# Altium schematic sheet connectors-extension.SchDoc
size A3; DocumentNumber: 10; SheetNumber: 10; SheetTotal: 45; SheetDescription: Connector to Extension Board
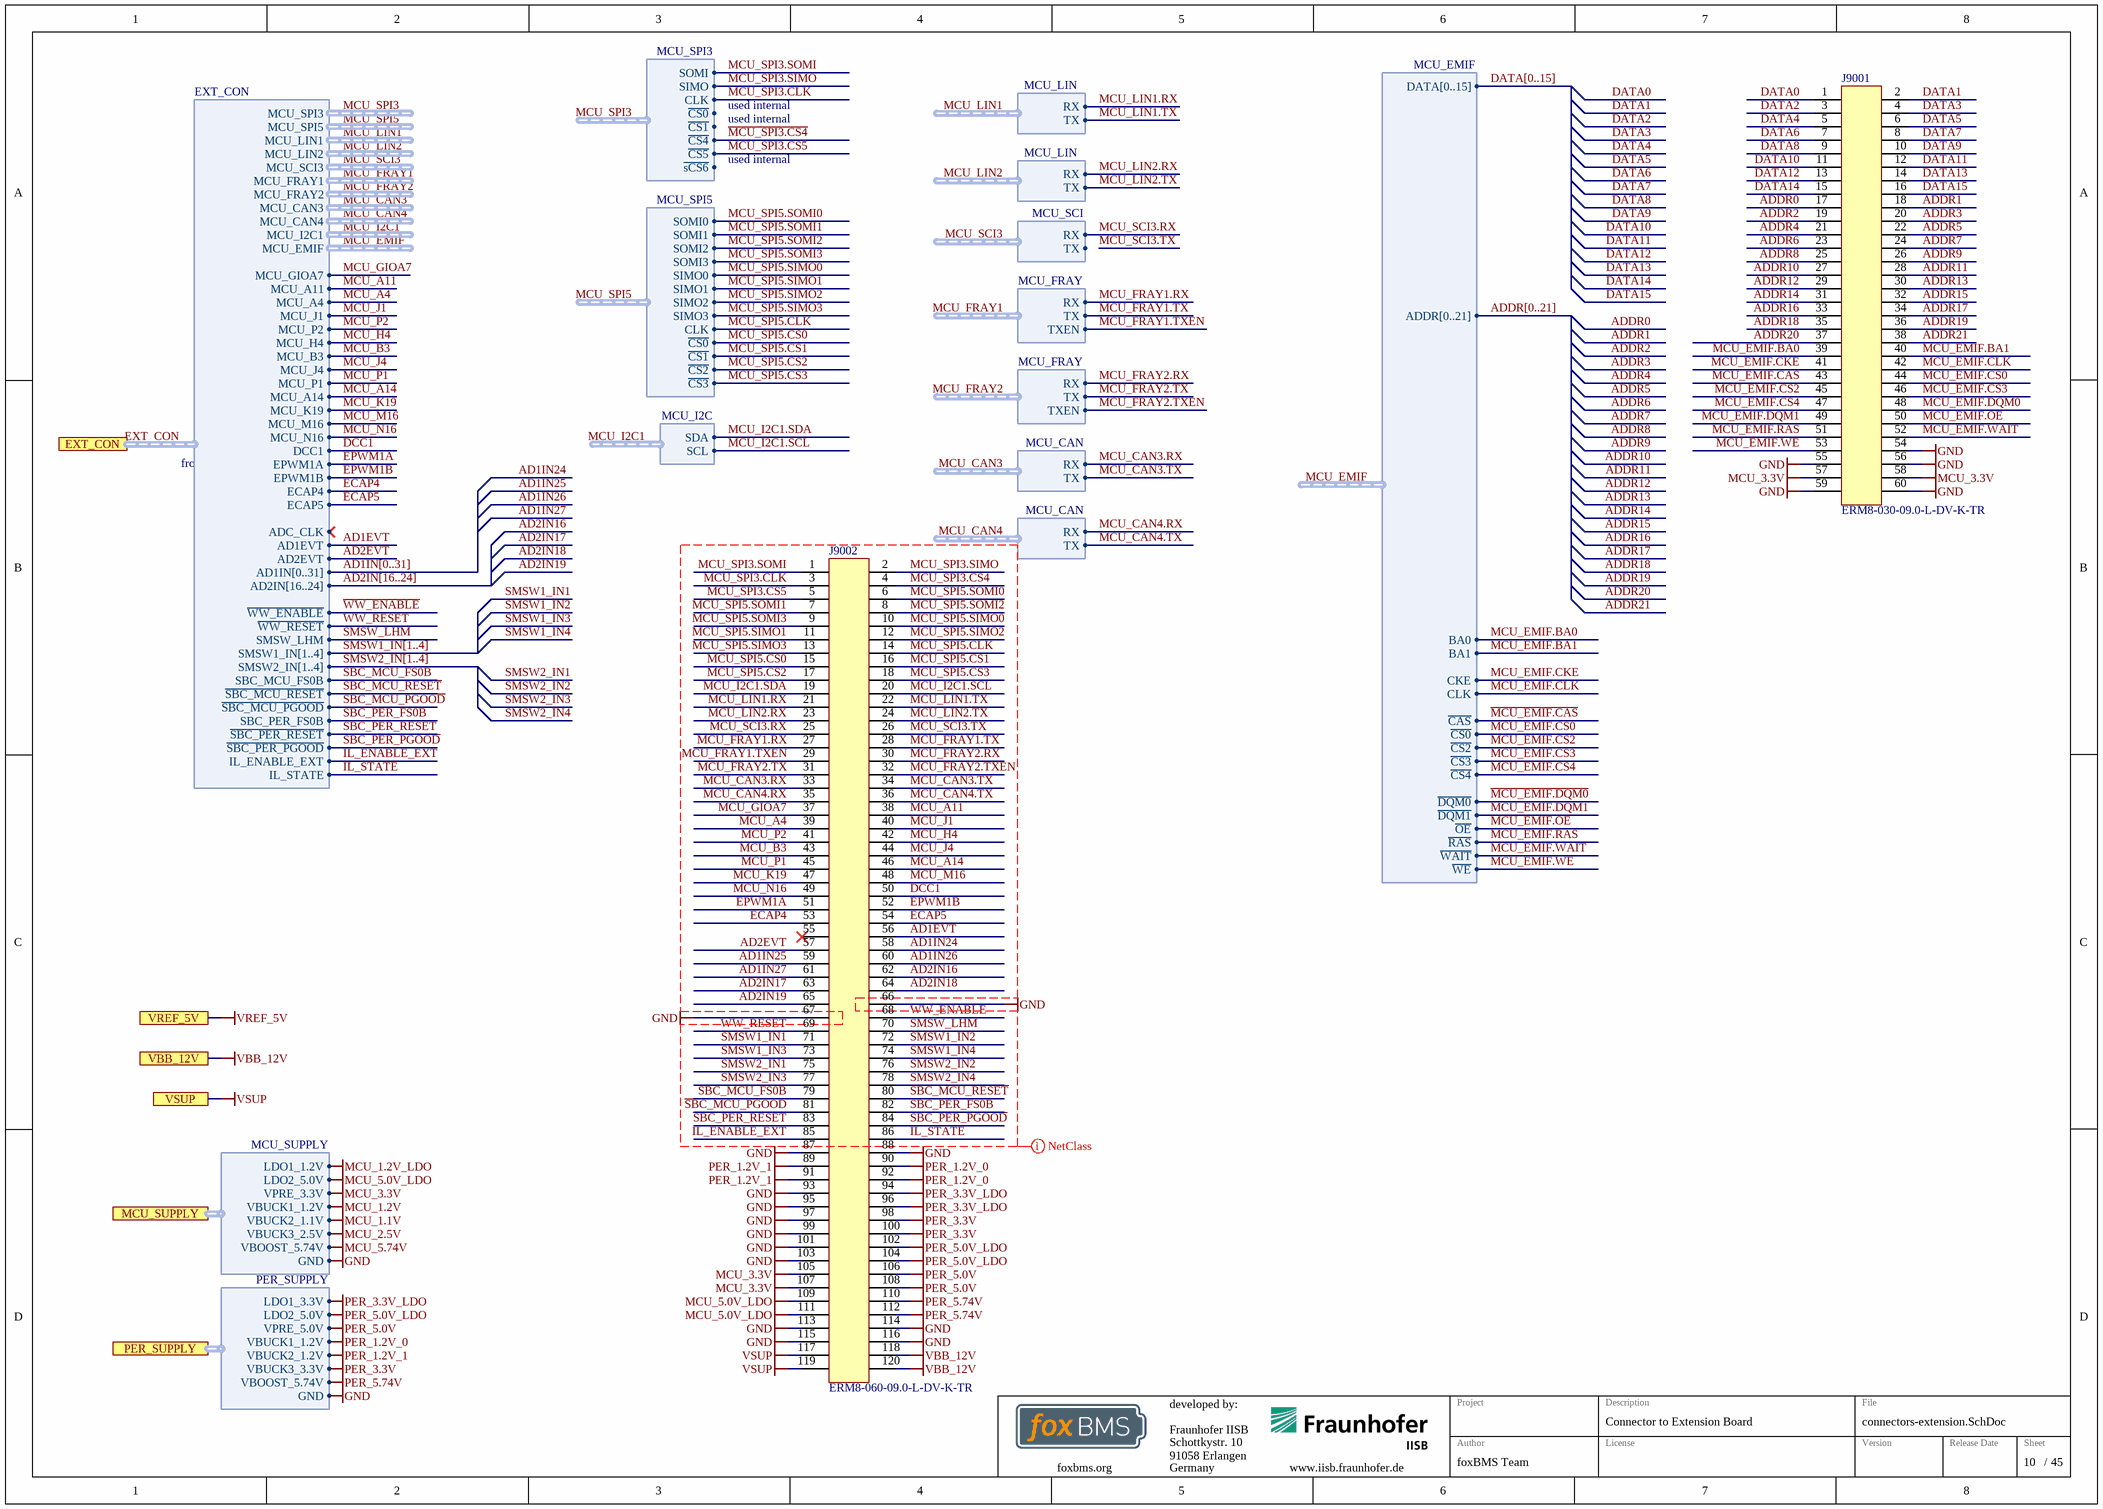
[diagram p0: connectors-extension.SchDoc]

## Parts
J9001  ERM8-030-09.0-L-DV-K-TR  [SAMTEC_ERM8-030-09.0-L-DV-K]
J9002  ERM8-060-09.0-L-DV-K-TR  [SAMTEC_ERM8-060-09.0-L-DV-K]

## Ports
EXT_CON (harness EXT_CON), MCU_SUPPLY (harness MCU_SUPPLY), PER_SUPPLY (harness PER_SUPPLY), VBB_12V, VREF_5V, VSUP

## Harnesses
MCU_SPI5: CLK, SIMO0, SOMI0, SOMI1, ~{CS1}, ~{CS2}, ~{CS3}, ~{CS0}, SIMO1, SIMO2, SIMO3, SOMI2, SOMI3
MCU_SPI3: CLK, SIMO, SOMI, ~{CS1}, ~{CS4}, ~{CS5}, ~{CS0}, ~{sCS6}
MCU_I2C: SDA, SCL
MCU_SUPPLY: VBUCK1_1.2V, VBUCK2_1.1V, VBUCK3_2.5V, LDO1_1.2V, LDO2_5.0V, GND, VPRE_3.3V, VBOOST_5.74V
PER_SUPPLY: GND, VBOOST_5.74V, LDO1_3.3V, LDO2_5.0V, VPRE_5.0V, VBUCK1_1.2V, VBUCK2_1.2V, VBUCK3_3.3V
MCU_EMIF: DATA[0..15], ADDR[0..21], BA0, BA1, CKE, CLK, ~{CAS}, ~{CS0}, ~{CS2}, ~{CS3}, ~{CS4}, ~{DQM1}, ~{DQM0}, ~{OE}, ~{RAS}, ~{WAIT}, ~{WE}
MCU_CAN: RX, TX
MCU_FRAY: RX, TX, TXEN
MCU_LIN: RX, TX
EXT_CON: MCU_SPI3, MCU_SPI5, MCU_LIN1, MCU_LIN2, MCU_FRAY1, MCU_FRAY2, MCU_CAN3, MCU_CAN4, MCU_I2C1, MCU_EMIF, DCC1, EPWM1A, EPWM1B, ECAP4, ECAP5, ADC_CLK, AD1EVT, AD2EVT, AD1IN[0..31], AD2IN[16..24], ~{WW_ENABLE}, ~{WW_RESET}, SMSW_LHM, SMSW1_IN[1..4], SMSW2_IN[1..4], SBC_MCU_FS0B, ~{SBC_MCU_RESET}, ~{SBC_MCU_PGOOD}, SBC_PER_FS0B, ~{SBC_PER_RESET}, ~{SBC_PER_PGOOD}, IL_ENABLE_EXT, IL_STATE, MCU_GIOA7, MCU_A11, MCU_A4, MCU_J1, MCU_P2, MCU_H4, MCU_B3, MCU_J4, MCU_P1, MCU_A14, MCU_K19, MCU_M16, MCU_N16, MCU_SCI3
MCU_SCI: RX, TX

## Nets
GND: J9001.54 J9001.55 J9001.56 J9001.59 J9001.60 J9002.66 J9002.67 J9002.87 J9002.88 J9002.93 J9002.95 J9002.97 J9002.99 J9002.101 J9002.103 J9002.113 J9002.114 J9002.115 J9002.116 ; port MCU_SUPPLY.GND, port PER_SUPPLY.GND
MCU_1.1V: port MCU_SUPPLY.VBUCK2_1.1V
MCU_1.2V: port MCU_SUPPLY.VBUCK1_1.2V
MCU_1.2V_LDO: port MCU_SUPPLY.LDO1_1.2V
MCU_2.5V: port MCU_SUPPLY.VBUCK3_2.5V
MCU_3.3V: J9001.57 J9001.58 J9002.105 J9002.107 ; port MCU_SUPPLY.VPRE_3.3V
MCU_5.0V_LDO: J9002.109 J9002.111 ; port MCU_SUPPLY.LDO2_5.0V
MCU_5.74V: port MCU_SUPPLY.VBOOST_5.74V
PER_1.2V_0: J9002.90 J9002.92 ; port PER_SUPPLY.VBUCK1_1.2V
PER_1.2V_1: J9002.89 J9002.91 ; port PER_SUPPLY.VBUCK2_1.2V
PER_3.3V: J9002.98 J9002.100 ; port PER_SUPPLY.VBUCK3_3.3V
PER_3.3V_LDO: J9002.94 J9002.96 ; port PER_SUPPLY.LDO1_3.3V
PER_5.0V: J9002.106 J9002.108 ; port PER_SUPPLY.VPRE_5.0V
PER_5.0V_LDO: J9002.102 J9002.104 ; port PER_SUPPLY.LDO2_5.0V
PER_5.74V: J9002.110 J9002.112 ; port PER_SUPPLY.VBOOST_5.74V
VBB_12V: J9002.118 J9002.120 ; port VBB_12V
VREF_5V: port VREF_5V
VSUP: J9002.117 J9002.119 ; port VSUP
~{MCU_EMIF.CAS}: J9001.43 ; harness MCU_EMIF.~{CAS}
~{MCU_EMIF.CS0}: J9001.44 ; harness MCU_EMIF.~{CS0}
~{MCU_EMIF.CS2}: J9001.45 ; harness MCU_EMIF.~{CS2}
~{MCU_EMIF.CS3}: J9001.46 ; harness MCU_EMIF.~{CS3}
~{MCU_EMIF.CS4}: J9001.47 ; harness MCU_EMIF.~{CS4}
~{MCU_EMIF.DQM0}: J9001.48 ; harness MCU_EMIF.~{DQM0}
~{MCU_EMIF.DQM1}: J9001.49 ; harness MCU_EMIF.~{DQM1}
~{MCU_EMIF.OE}: J9001.50 ; harness MCU_EMIF.~{OE}
~{MCU_EMIF.RAS}: J9001.51 ; harness MCU_EMIF.~{RAS}
~{MCU_EMIF.WAIT}: J9001.52 ; harness MCU_EMIF.~{WAIT}
~{MCU_EMIF.WE}: J9001.53 ; harness MCU_EMIF.~{WE}
~{MCU_SPI3.CS4}: J9002.4 ; harness MCU_SPI3.~{CS4}
~{MCU_SPI3.CS5}: J9002.5 ; harness MCU_SPI3.~{CS5}
~{MCU_SPI5.CS0}: J9002.15 ; harness MCU_SPI5.~{CS0}
~{MCU_SPI5.CS1}: J9002.16 ; harness MCU_SPI5.~{CS1}
~{MCU_SPI5.CS2}: J9002.17 ; harness MCU_SPI5.~{CS2}
~{MCU_SPI5.CS3}: J9002.18 ; harness MCU_SPI5.~{CS3}
~{SBC_MCU_PGOOD}: J9002.81 ; port EXT_CON.~{SBC_MCU_PGOOD}
~{SBC_MCU_RESET}: J9002.80 ; port EXT_CON.~{SBC_MCU_RESET}
~{SBC_PER_PGOOD}: J9002.84 ; port EXT_CON.~{SBC_PER_PGOOD}
~{SBC_PER_RESET}: J9002.83 ; port EXT_CON.~{SBC_PER_RESET}
~{WW_ENABLE}: J9002.68 ; port EXT_CON.~{WW_ENABLE}
~{WW_RESET}: J9002.69 ; port EXT_CON.~{WW_RESET}
AD1EVT: J9002.56 ; port EXT_CON.AD1EVT
AD1IN24: J9002.58
AD1IN25: J9002.59
AD1IN26: J9002.60
AD1IN27: J9002.61
AD2EVT: J9002.57 ; port EXT_CON.AD2EVT
AD2IN16: J9002.62
AD2IN17: J9002.63
AD2IN18: J9002.64
AD2IN19: J9002.65
ADDR0: J9001.17
ADDR1: J9001.18
ADDR2: J9001.19
ADDR3: J9001.20
ADDR4: J9001.21
ADDR5: J9001.22
ADDR6: J9001.23
ADDR7: J9001.24
ADDR8: J9001.25
ADDR9: J9001.26
ADDR10: J9001.27
ADDR11: J9001.28
ADDR12: J9001.29
ADDR13: J9001.30
ADDR14: J9001.31
ADDR15: J9001.32
ADDR16: J9001.33
ADDR17: J9001.34
ADDR18: J9001.35
ADDR19: J9001.36
ADDR20: J9001.37
ADDR21: J9001.38
DATA0: J9001.1
DATA1: J9001.2
DATA2: J9001.3
DATA3: J9001.4
DATA4: J9001.5
DATA5: J9001.6
DATA6: J9001.7
DATA7: J9001.8
DATA8: J9001.9
DATA9: J9001.10
DATA10: J9001.11
DATA11: J9001.12
DATA12: J9001.13
DATA13: J9001.14
DATA14: J9001.15
DATA15: J9001.16
DCC1: J9002.50 ; port EXT_CON.DCC1
ECAP4: J9002.53 ; port EXT_CON.ECAP4
ECAP5: J9002.54 ; port EXT_CON.ECAP5
EPWM1A: J9002.51 ; port EXT_CON.EPWM1A
EPWM1B: J9002.52 ; port EXT_CON.EPWM1B
IL_ENABLE_EXT: J9002.85 ; port EXT_CON.IL_ENABLE_EXT  [project net EXT_CON.IL_ENABLE_EXT]
IL_STATE: J9002.86 ; port EXT_CON.IL_STATE  [project net EXT_CON.IL_STATE]
MCU_A4: J9002.39 ; port EXT_CON.MCU_A4  [project net EXT_CON.MCU_A4]
MCU_A11: J9002.38 ; port EXT_CON.MCU_A11  [project net EXT_CON.MCU_A11]
MCU_A14: J9002.46 ; port EXT_CON.MCU_A14  [project net EXT_CON.MCU_A14]
MCU_B3: J9002.43 ; port EXT_CON.MCU_B3  [project net EXT_CON.MCU_B3]
MCU_CAN3.RX: J9002.33 ; harness MCU_CAN.RX
MCU_CAN3.TX: J9002.34 ; harness MCU_CAN.TX
MCU_CAN4.RX: J9002.35 ; harness MCU_CAN.RX
MCU_CAN4.TX: J9002.36 ; harness MCU_CAN.TX
MCU_EMIF.BA0: J9001.39 ; harness MCU_EMIF.BA0
MCU_EMIF.BA1: J9001.40 ; harness MCU_EMIF.BA1
MCU_EMIF.CKE: J9001.41 ; harness MCU_EMIF.CKE
MCU_EMIF.CLK: J9001.42 ; harness MCU_EMIF.CLK
MCU_FRAY1.RX: J9002.27 ; harness MCU_FRAY.RX
MCU_FRAY1.TX: J9002.28 ; harness MCU_FRAY.TX
MCU_FRAY1.TXEN: J9002.29 ; harness MCU_FRAY.TXEN
MCU_FRAY2.RX: J9002.30 ; harness MCU_FRAY.RX
MCU_FRAY2.TX: J9002.31 ; harness MCU_FRAY.TX
MCU_FRAY2.TXEN: J9002.32 ; harness MCU_FRAY.TXEN
MCU_GIOA7: J9002.37 ; port EXT_CON.MCU_GIOA7  [project net EXT_CON.MCU_GIOA7]
MCU_H4: J9002.42 ; port EXT_CON.MCU_H4  [project net EXT_CON.MCU_H4]
MCU_I2C1.SCL: J9002.20 ; harness MCU_I2C.SCL
MCU_I2C1.SDA: J9002.19 ; harness MCU_I2C.SDA
MCU_J1: J9002.40 ; port EXT_CON.MCU_J1  [project net EXT_CON.MCU_J1]
MCU_J4: J9002.44 ; port EXT_CON.MCU_J4  [project net EXT_CON.MCU_J4]
MCU_K19: J9002.47 ; port EXT_CON.MCU_K19  [project net EXT_CON.MCU_K19]
MCU_LIN1.RX: J9002.21 ; harness MCU_LIN.RX
MCU_LIN1.TX: J9002.22 ; harness MCU_LIN.TX
MCU_LIN2.RX: J9002.23 ; harness MCU_LIN.RX
MCU_LIN2.TX: J9002.24 ; harness MCU_LIN.TX
MCU_M16: J9002.48 ; port EXT_CON.MCU_M16  [project net EXT_CON.MCU_M16]
MCU_N16: J9002.49 ; port EXT_CON.MCU_N16  [project net EXT_CON.MCU_N16]
MCU_P1: J9002.45 ; port EXT_CON.MCU_P1  [project net EXT_CON.MCU_P1]
MCU_P2: J9002.41 ; port EXT_CON.MCU_P2  [project net EXT_CON.MCU_P2]
MCU_SCI3.RX: J9002.25 ; harness MCU_SCI.RX
MCU_SCI3.TX: J9002.26
MCU_SPI3.CLK: J9002.3 ; harness MCU_SPI3.CLK
MCU_SPI3.SIMO: J9002.2 ; harness MCU_SPI3.SIMO
MCU_SPI3.SOMI: J9002.1 ; harness MCU_SPI3.SOMI
MCU_SPI5.CLK: J9002.14 ; harness MCU_SPI5.CLK
MCU_SPI5.SIMO0: J9002.10 ; harness MCU_SPI5.SIMO0
MCU_SPI5.SIMO1: J9002.11 ; harness MCU_SPI5.SIMO1
MCU_SPI5.SIMO2: J9002.12 ; harness MCU_SPI5.SIMO2
MCU_SPI5.SIMO3: J9002.13 ; harness MCU_SPI5.SIMO3
MCU_SPI5.SOMI0: J9002.6 ; harness MCU_SPI5.SOMI0
MCU_SPI5.SOMI1: J9002.7 ; harness MCU_SPI5.SOMI1
MCU_SPI5.SOMI2: J9002.8 ; harness MCU_SPI5.SOMI2
MCU_SPI5.SOMI3: J9002.9 ; harness MCU_SPI5.SOMI3
SBC_MCU_FS0B: J9002.79 ; port EXT_CON.SBC_MCU_FS0B  [project net EXT_CON.SBC_MCU_FS0B]
SBC_PER_FS0B: J9002.82 ; port EXT_CON.SBC_PER_FS0B  [project net EXT_CON.SBC_PER_FS0B]
SMSW1_IN1: J9002.71
SMSW1_IN2: J9002.72
SMSW1_IN3: J9002.73
SMSW1_IN4: J9002.74
SMSW2_IN1: J9002.75
SMSW2_IN2: J9002.76
SMSW2_IN3: J9002.77
SMSW2_IN4: J9002.78
SMSW_LHM: J9002.70 ; port EXT_CON.SMSW_LHM  [project net EXT_CON.SMSW_LHM]

Not connected (* = marked no-connect by the designer): J9002 55*

## Buses and harness runs
bus AD1IN[0..31]
bus AD2IN[16..24]
bus ADDR[0..21]
bus DATA[0..15]
bus SMSW1_IN[1..4]
bus SMSW2_IN[1..4]
harness EXT_CON = port EXT_CON

## Layout directives
net class CON_EXTENSION: AD1EVT, AD1IN24, AD1IN25, AD1IN26, AD1IN27, AD2EVT, AD2IN16, AD2IN17, AD2IN18, AD2IN19, DCC1, ECAP4, ECAP5, EPWM1A, EPWM1B, IL_ENABLE_EXT, IL_STATE, MCU_A4, MCU_A11, MCU_A14, MCU_B3, MCU_CAN3.RX, MCU_CAN3.TX, MCU_CAN4.RX, MCU_CAN4.TX, MCU_FRAY1.RX, MCU_FRAY1.TX, MCU_FRAY1.TXEN, MCU_FRAY2.RX, MCU_FRAY2.TX, MCU_FRAY2.TXEN, MCU_GIOA7, MCU_H4, MCU_I2C1.SCL, MCU_I2C1.SDA, MCU_J1, MCU_J4, MCU_K19, MCU_LIN1.RX, MCU_LIN1.TX, MCU_LIN2.RX, MCU_LIN2.TX, MCU_M16, MCU_N16, MCU_P1, MCU_P2, MCU_SCI3.RX, MCU_SCI3.TX, MCU_SPI3.CLK, MCU_SPI3.SIMO, MCU_SPI3.SOMI, MCU_SPI5.CLK, MCU_SPI5.SIMO0, MCU_SPI5.SIMO1, MCU_SPI5.SIMO2, MCU_SPI5.SIMO3, MCU_SPI5.SOMI0, MCU_SPI5.SOMI1, MCU_SPI5.SOMI2, MCU_SPI5.SOMI3, SBC_MCU_FS0B, SBC_PER_FS0B, SMSW1_IN1, SMSW1_IN2, SMSW1_IN3, SMSW1_IN4, SMSW2_IN1, SMSW2_IN2, SMSW2_IN3, SMSW2_IN4, SMSW_LHM, ~{MCU_SPI3.CS4}, ~{MCU_SPI3.CS5}, ~{MCU_SPI5.CS0}, ~{MCU_SPI5.CS1}, ~{MCU_SPI5.CS2}, ~{MCU_SPI5.CS3}, ~{SBC_MCU_PGOOD}, ~{SBC_MCU_RESET}, ~{SBC_PER_PGOOD}, ~{SBC_PER_RESET}, ~{WW_ENABLE}, ~{WW_RESET}

## Notes on the sheet
- used internal
- from IO matrix
- Fraunhofer IISB
- Schottkystr. 10
- developed by:
- 91058 Erlangen
- Germany
- Author
- Project
- License
- Description
- File
- Version
- Release Date
- Sheet
- foxbms.org <https://foxbms.org>
- www.iisb.fraunhofer.de <https://www.iisb.fraunhofer.de/>
- foxBMS Team
- /

## Library data of the parts
J9001 = SAMTEC_ERM8-030-09.0-L-DV-K-TR: Edge Rate rugged high-speed connector strips; Manufacturer: Samtec; Circuits: 60; Automotive Qualified: False; Part Number: SAMTEC_ERM8-030-09.0-L-DV-K-TR; Part Name: ERM8-030-09.0-L-DV-K-TR; Operating Temperature: -55°C - +125°C; ComponentLink1Description: Datasheet; ComponentLink1URL: https://suddendocs.samtec.com/catalog_english/erm8.pdf; Supplier 1: Digikey; Supplier Part Number 1: SAM13766CT-ND; Supplier 2: Mouser; Supplier Part Number 2: 200-ERM8030090LDVKTR; ECCN: EAR99
J9002 = SAMTEC_ERM8-060-09.0-L-DV-K-TR: Edge Rate rugged high-speed connector strips; Manufacturer: Samtec; Circuits: 120; Automotive Qualified: False; Part Number: SAMTEC_ERM8-060-09.0-L-DV-K-TR; Part Name: ERM8-060-09.0-L-DV-K-TR; Operating Temperature: -55°C - +125°C; ComponentLink1Description: Datasheet; ComponentLink1URL: https://suddendocs.samtec.com/catalog_english/erm8.pdf; Supplier 1: Digikey; Supplier Part Number 1: SAM13147CT-ND; Supplier 2: Mouser; Supplier Part Number 2: 200-ERM8060090LDVKTR; ECCN: EAR99